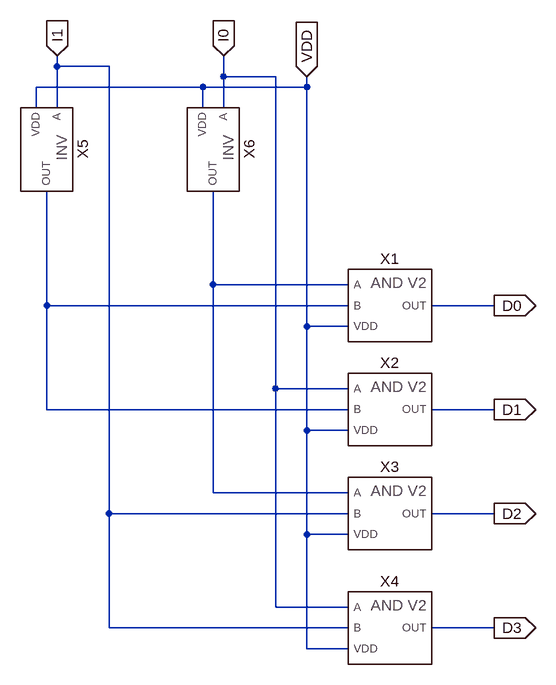
[diagram p0: schematic dec2to4_V2.asc]
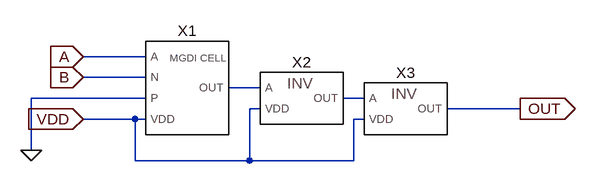
[diagram p1: sub-circuit and_v2.asc]
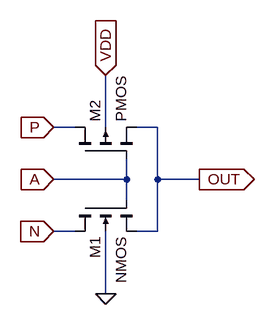
[diagram p2: sub-circuit gdicell.asc]
dec2to4_V2.asc, the LTspice schematic file:
Version 4
SHEET 1 1500 776
WIRE -224 -336 -224 -352
WIRE -144 -336 -224 -336
WIRE 32 -320 32 -352
WIRE 112 -320 32 -320
WIRE 0 -304 -256 -304
WIRE 160 -304 160 -320
WIRE 160 -304 0 -304
WIRE -256 -272 -256 -304
WIRE -224 -272 -224 -336
WIRE 0 -272 0 -304
WIRE 32 -272 32 -320
WIRE 16 0 16 -144
WIRE 224 0 16 0
WIRE -240 32 -240 -144
WIRE 224 32 -240 32
WIRE 448 32 352 32
WIRE 160 64 160 -304
WIRE 224 64 160 64
WIRE 112 160 112 -320
WIRE 224 160 112 160
WIRE -240 192 -240 32
WIRE 224 192 -240 192
WIRE 448 192 352 192
WIRE 160 224 160 64
WIRE 224 224 160 224
WIRE 16 320 16 0
WIRE 224 320 16 320
WIRE -144 352 -144 -336
WIRE 224 352 -144 352
WIRE 448 352 352 352
WIRE 160 384 160 224
WIRE 224 384 160 384
WIRE 112 496 112 160
WIRE 224 496 112 496
WIRE -144 528 -144 352
WIRE 224 528 -144 528
WIRE 448 528 352 528
WIRE 160 560 160 384
WIRE 224 560 160 560
FLAG -224 -352 I1
IOPIN -224 -352 In
FLAG 32 -352 I0
IOPIN 32 -352 In
FLAG 160 -320 VDD
IOPIN 160 -320 In
FLAG 448 32 D0
IOPIN 448 32 Out
FLAG 448 192 D1
IOPIN 448 192 Out
FLAG 448 352 D2
IOPIN 448 352 Out
FLAG 448 528 D3
IOPIN 448 528 Out
SYMBOL INVgdi -240 -208 R90
SYMATTR InstName X5
SYMBOL INVgdi 16 -208 R90
SYMATTR InstName X6
SYMBOL AND_V2 288 32 R0
SYMATTR InstName X1
SYMBOL AND_V2 288 192 R0
SYMATTR InstName X2
SYMBOL AND_V2 288 352 R0
SYMATTR InstName X3
SYMBOL AND_V2 288 528 R0
SYMATTR InstName X4

and_v2.asc, the sub-circuit schematic file:
Version 4
SHEET 1 880 680
WIRE -32 192 -128 192
WIRE -32 224 -128 224
WIRE 144 240 96 240
WIRE -32 256 -208 256
WIRE 304 256 272 256
WIRE 144 272 128 272
WIRE 544 272 432 272
WIRE -48 288 -128 288
WIRE -32 288 -48 288
WIRE 304 288 288 288
WIRE -208 336 -208 256
WIRE -48 352 -48 288
WIRE 128 352 128 272
WIRE 128 352 -48 352
WIRE 288 352 288 288
WIRE 288 352 128 352
FLAG -128 192 A
IOPIN -128 192 In
FLAG -128 224 B
IOPIN -128 224 In
FLAG -128 288 VDD
IOPIN -128 288 In
FLAG 544 272 OUT
IOPIN 544 272 Out
FLAG -208 336 0
SYMBOL GDICell 32 240 R0
SYMATTR InstName X1
SYMBOL INVgdi 208 256 R0
SYMATTR InstName X2
SYMBOL INVgdi 368 272 R0
SYMATTR InstName X3

gdicell.asc, the sub-circuit schematic file:
Version 4
SHEET 1 1484 2272
WIRE 176 96 144 96
WIRE 224 96 224 16
WIRE 304 96 272 96
WIRE 256 176 256 144
WIRE 256 176 144 176
WIRE 304 176 304 96
WIRE 368 176 304 176
WIRE 256 208 256 176
WIRE 176 256 144 256
WIRE 304 256 304 176
WIRE 304 256 272 256
WIRE 224 352 224 256
FLAG 144 96 P
IOPIN 144 96 In
FLAG 144 256 N
IOPIN 144 256 In
FLAG 144 176 A
IOPIN 144 176 In
FLAG 368 176 OUT
IOPIN 368 176 Out
FLAG 224 16 VDD
IOPIN 224 16 In
FLAG 224 352 0
SYMBOL nmos4 176 208 M90
SYMATTR InstName M1
SYMATTR Value2 l=65nm w=65nm
SYMBOL pmos4 176 144 R270
SYMATTR InstName M2
SYMATTR Value2 l=65nm w=162.5nm

The netlist it stands for:
* dec2to4_V2.asc
XX5 I1 VDD N002 INVgdi  ; pins A VDD OUT
XX6 I0 VDD N001 INVgdi  ; pins A VDD OUT
XX1 N001 N002 VDD D0 and_v2
XX2 I0 N002 VDD D1 and_v2
XX3 N001 I1 VDD D2 and_v2
XX4 I0 I1 VDD D3 and_v2

* block symbol definitions
.subckt and_v2 A B VDD OUT
XX1 A B 0 VDD N001 gdicell
XX2 N001 VDD N002 INVgdi  ; pins A VDD OUT
XX3 N002 VDD OUT INVgdi  ; pins A VDD OUT
.ends and_v2

.subckt gdicell A N P VDD OUT
M1 N A OUT 0 NMOS l=65nm w=65nm
M2 P A OUT VDD PMOS l=65nm w=162.5nm
.ends gdicell

.model NMOS NMOS
.model PMOS PMOS
.lib standard.mos
.backanno
.end